# EAGLE design gbit-poe-splitter (EAGLE 9.6.2)
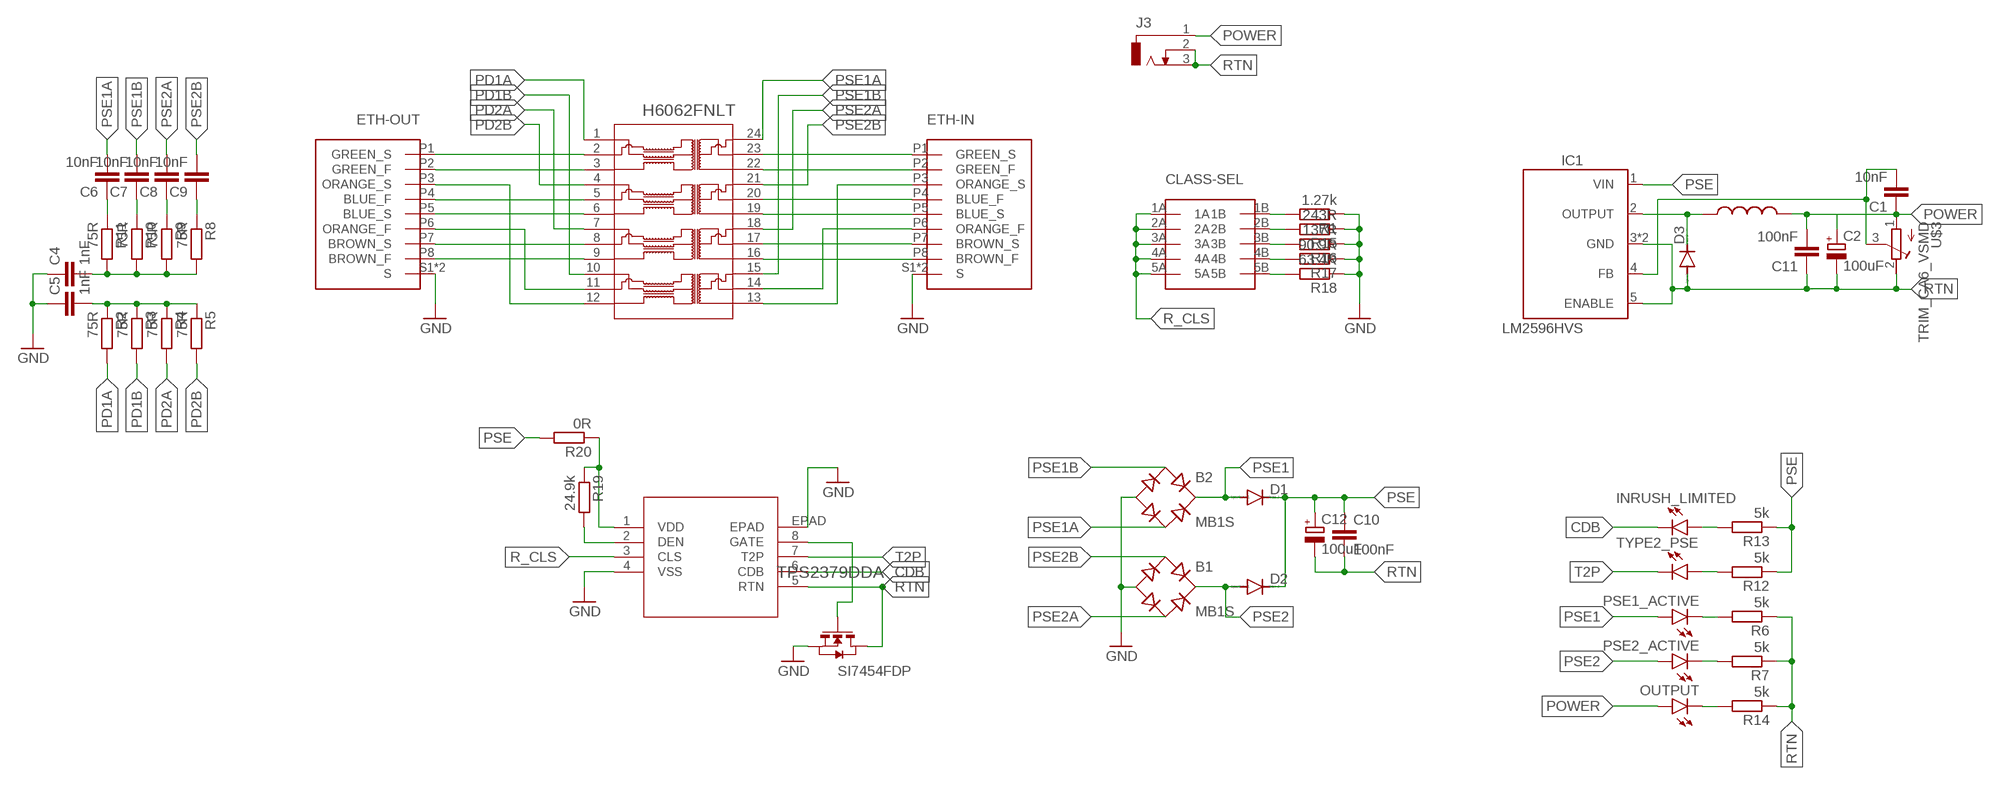
[diagram p0: schematic, sheet 1]

## Parts
B1  MB1S  [SOIC-4]
B2  MB1S  [SOIC-4]
C1  10nF  C-EUC0603K  [C0603K]
C2  100uF  CPOL-EU153CLV-1012  [153CLV-1012]
C4  1nF  C-EUC0603K  [C0603K]
C5  1nF  C-EUC0603K  [C0603K]
C6  10nF  C-EUC0603K  [C0603K]
C7  10nF  C-EUC0603K  [C0603K]
C8  10nF  C-EUC0603K  [C0603K]
C9  10nF  C-EUC0603K  [C0603K]
C10  100nF  C-EUC0805  [C0805]
C11  100nF  C-EUC0805  [C0805]
C12  100uF  CPOL-EU153CLV-1012  [153CLV-1012]
CLASS-SEL  54202-T0803AB01LF  [54202-T0803AB01LF]
D1  DIODE-DO-214AC  [DO-214AC]
D2  DIODE-DO-214AC  [DO-214AC]
D3  DIODE-DO-214AC  [DO-214AC]
ETH-IN  RJLSE-4X1XX-01  [RJLSE-4X1XX-01]
ETH-OUT  RJLSE-4X1XX-01  [RJLSE-4X1XX-01]
IC1  LM2596HVS  [TO263-5]
INRUSH_LIMITED  LEDCHIPLED_0603  [CHIPLED_0603]
J3  DCJ0303  [DCJ0303]
OUTPUT  LEDCHIPLED_0603  [CHIPLED_0603]
PSE1_ACTIVE  LEDCHIPLED_0603  [CHIPLED_0603]
PSE2_ACTIVE  LEDCHIPLED_0603  [CHIPLED_0603]
R1  1.27k  R-EU_R0603  [R0603]
R2  75R  R-EU_R0603  [R0603]
R3  75R  R-EU_R0603  [R0603]
R4  75R  R-EU_R0603  [R0603]
R5  75R  R-EU_R0603  [R0603]
R6  5k  R-EU_R0603  [R0603]
R7  5k  R-EU_R0603  [R0603]
R8  75R  R-EU_R0603  [R0603]
R9  75R  R-EU_R0603  [R0603]
R10  75R  R-EU_R0603  [R0603]
R11  75R  R-EU_R0603  [R0603]
R12  5k  R-EU_R0603  [R0603]
R13  5k  R-EU_R0603  [R0603]
R14  5k  R-EU_R0603  [R0603]
R15  243R  R-EU_R0603  [R0603]
R16  137R  R-EU_R0603  [R0603]
R17  90.9R  R-EU_R0603  [R0603]
R18  63.4R  R-EU_R0603  [R0603]
R19  24.9k  R-EU_R0603  [R0603]
R20  0R  R-EU_R1206  [R1206]
TYPE2_PSE  LEDCHIPLED_0603  [CHIPLED_0603]
U1  TPS2379DDA  [DDA8_3P1X2P4_TEX]
U$1  SI7454FDP  [POWERPAK-SO-8]
U$2  INDUCTOR-SMD7070  [INDUCTOR-SMD]
U$3  TRIM_CA6_VSMD  [TRIM_CA6_VSMD]
XMER1  H6062FNLT  [H6062FNLT_PUL]

## Nets
CDB: INRUSH_LIMITED.C U1.6(CDB)
GND: B1.- B2.- C4.1 C5.1 ETH-IN.S1(S) ETH-IN.S2(S) ETH-OUT.S1(S) ETH-OUT.S2(S) R1.1 R15.1 R16.1 R17.1 R18.1 U1.4(VSS) U1.EPAD U$1.S1(S) U$1.S2(S) U$1.S3(S)
N$1: ETH-OUT.P1(GREEN_S) XMER1.2
N$2: ETH-OUT.P2(GREEN_F) XMER1.3
N$3: ETH-OUT.P3(ORANGE_S) XMER1.12
N$4: ETH-OUT.P4(BLUE_F) XMER1.5
N$5: ETH-OUT.P5(BLUE_S) XMER1.6
N$6: ETH-OUT.P6(ORANGE_F) XMER1.11
N$7: ETH-OUT.P7(BROWN_S) XMER1.8
N$8: ETH-OUT.P8(BROWN_F) XMER1.9
N$9: ETH-IN.P7(BROWN_S) XMER1.17
N$10: ETH-IN.P4(BLUE_F) XMER1.20
N$11: ETH-IN.P8(BROWN_F) XMER1.16
N$12: ETH-IN.P5(BLUE_S) XMER1.19
N$13: ETH-IN.P6(ORANGE_F) XMER1.14
N$14: ETH-IN.P3(ORANGE_S) XMER1.13
N$15: ETH-IN.P2(GREEN_F) XMER1.22
N$16: ETH-IN.P1(GREEN_S) XMER1.23
N$18: C5.2 R2.1 R3.1 R4.1 R5.1
N$19: C4.2 R8.2 R9.2 R10.2 R11.2
N$20: C6.1 R11.1
N$21: C7.1 R10.1
N$22: C8.1 R9.1
N$23: C9.1 R8.1
N$24: PSE1_ACTIVE.C R6.2
N$25: PSE2_ACTIVE.C R7.2
N$26: R12.2 TYPE2_PSE.A
N$27: INRUSH_LIMITED.A R13.2
N$28: OUTPUT.C R14.2
N$29: CLASS-SEL.1B R1.2
N$30: CLASS-SEL.2B R15.2
N$31: CLASS-SEL.3B R16.2
N$32: CLASS-SEL.4B R17.2
N$33: CLASS-SEL.5B R18.2
N$34: D3.C IC1.2(OUTPUT) U$2.1
N$35: U1.8(GATE) U$1.G
N$36: R19.2 U1.2(DEN)
N$37: C1.2 IC1.4(FB) U$3.3(S)
N$38: R19.1 R20.1 U1.1(VDD)
PD1A: R2.2 XMER1.1
PD1B: R3.2 XMER1.10
PD2A: R4.2 XMER1.7
PD2B: R5.2 XMER1.4
POWER: C1.1 C2.+ C11.2 J3.1 OUTPUT.A U$2.2 U$3.1(A)
PSE: C10.1 C12.+ D1.C D2.C IC1.1(VIN) R12.1 R13.1 R20.2
PSE1: B2.+ D1.A PSE1_ACTIVE.A
PSE1A: B2.~2(AC2) C6.2 XMER1.24
PSE1B: B2.~1(AC1) C7.2 XMER1.15
PSE2: B1.+ D2.A PSE2_ACTIVE.A
PSE2A: B1.~2(AC2) C8.2 XMER1.18
PSE2B: B1.~1(AC1) C9.2 XMER1.21
R_CLS: CLASS-SEL.1A CLASS-SEL.2A CLASS-SEL.3A CLASS-SEL.4A CLASS-SEL.5A U1.3(CLS)
RTN: C2.- C10.2 C11.1 C12.- D3.A IC1.3(GND) IC1.5(ENABLE) IC1.6(GND) J3.2 J3.3 R6.1 R7.1 R14.1 U1.5(RTN) U$1.D1(D) U$1.D2(D) U$1.D3(D) U$1.D4(D) U$1.DPAD(D) U$3.2(E)
T2P: TYPE2_PSE.C U1.7(T2P)

## Library data of the parts
B1 B2 = rectifier:MB*S: Bridge Rectifier Source: http://www.fairchildsemi.com/ds/MB/MB6S.pdf
C1 C4-C11 = rcl:C-EU: CAPACITOR, European symbol; SPICEPREFIX: C
C2 C12 = rcl:CPOL-EU: POLARIZED CAPACITOR, European symbol; SPICEPREFIX: C
CLASS-SEL = 54202-T0803AB01LF:54202-T0803AB01LF
D1-D3 = diode:DIODE-: DIODE
ETH-IN ETH-OUT = RJLSE-4X1XX-01:RJLSE-4X1XX-01
IC1 = LM2596HV:LM2596HV
INRUSH_LIMITED OUTPUT PSE1_ACTIVE PSE2_ACTIVE TYPE2_PSE = led:LED: LED OSRAM: - CHIPLED LG R971, LG N971, LY N971, LG Q971, LY Q971, LO R971, LY R971 LH N974, LH R974 LS Q976, LO Q976, LY Q976 LO Q996 - Hyper CHIPLED LW Q18S LB Q993, LB Q99A, LB R99A - SideLED LS A670, LO A670, LY A670, LG A670, LP A670 LB A673, LV A673, LT A673, LW A673 LH A674 LY A675 LS A676, LA A676, LO A676, LY A676, LW A676 LS A679, LY A679, LG A679 - Hyper Micro SIDELED® LS Y876, LA Y876, LO Y876, LY Y876 LT Y87S - SmartLED LW L88C, LW L88S LB L89C, LB L89S, LG L890 LS L89K, LO L89K, LY L89K LS L896, LA L896, LO L896, LY L896 - TOPLED LS T670, LO T670, LY T670, LG T670, LP T670 LSG T670, LSP T670, LSY T670, LOP T670, LYG T670 LG T671, LOG T671, LSG T671 LB T673, LV T673, LT T673, LW T673 LH T674 LS T676, LA T676, LO T676, LY T676, LB T676, LH T676, LSB T676, LW T676 LB T67C, LV T67C, LT T67C, LS T67K, LO T67K, LY T67K, LW E67C LS E67B, LA E67B, LO E67B, LY E67B, LB E67C, LV E67C, LT E67C LW T67C LS T679, LY T679, LG T679 LS T770, LO T770, LY T770, LG T770, LP T770 LB T773, LV T773, LT T773, LW T773 LH T774 LS E675, LA E675, LY E675, LS T675 LS T776, LA T776, LO T776, LY T776, LB T776 LHGB T686 LT T68C, LB T68C - Hyper Mini TOPLED® LB M676 - Mini TOPLED Santana® LG M470 LS M47K, LO M47K, LY M47K Source: http://www.osram.convergy.de LUXEON: - LUMILED® LXK2-PW12-R00, LXK2-PW12-S00, LXK2-PW14-U00, LXK2-PW14-V00 LXK2-PM12-R00, LXK2-PM12-S00, LXK2-PM14-U00 LXK2-PE12-Q00, LXK2-PE12-R00, LXK2-PE12-S00, LXK2-PE14-T00, LXK2-PE14-U00 LXK2-PB12-K00, LXK2-PB12-L00, LXK2-PB12-M00, LXK2-PB14-N00, LXK2-PB14-P00, LXK2-PB14-Q00 LXK2-PR12-L00, LXK2-PR12-M00, LXK2-PR14-Q00, LXK2-PR14-R00 LXK2-PD12-Q00, LXK2-PD12-R00, LXK2-PD12-S00 LXK2-PH12-R00, LXK2-PH12-S00 LXK2-PL12-P00, LXK2-PL12-Q00, LXK2-PL12-R00 Source: www.luxeon.com KINGBRIGHT: KA-3528ASYC Source: www.kingbright.com
J3 = con-jack:DCJ0303: DC POWER JACK Source: DCJ0303.pdf; OC_FARNELL: unknown; OC_NEWARK: unknown
R1-R20 = rcl:R-EU_: RESISTOR, European symbol; SPICEPREFIX: R
U1 = TPS2379:TPS2379DDA; COPYRIGHT: Copyright (C) 2021 Ultra Librarian. All rights reserved.; MANUFACTURER_PART_NUMBER: TPS2379DDA; MFR_NAME: Texas Instruments
U$1 = SI7454FDP:SI7454FDP
U$2 = smd-inductors:INDUCTOR-SMD
U$3 = TRIM_CA6_VSMD:TRIM_CA6_VSMD
XMER1 = H6062FNLT:H6062FNLT; COPYRIGHT: Copyright (C) 2021 Ultra Librarian. All rights reserved.; MANUFACTURER_PART_NUMBER: H6062FNLT; MFR_NAME: Pulse Electronics Corporation

## Board
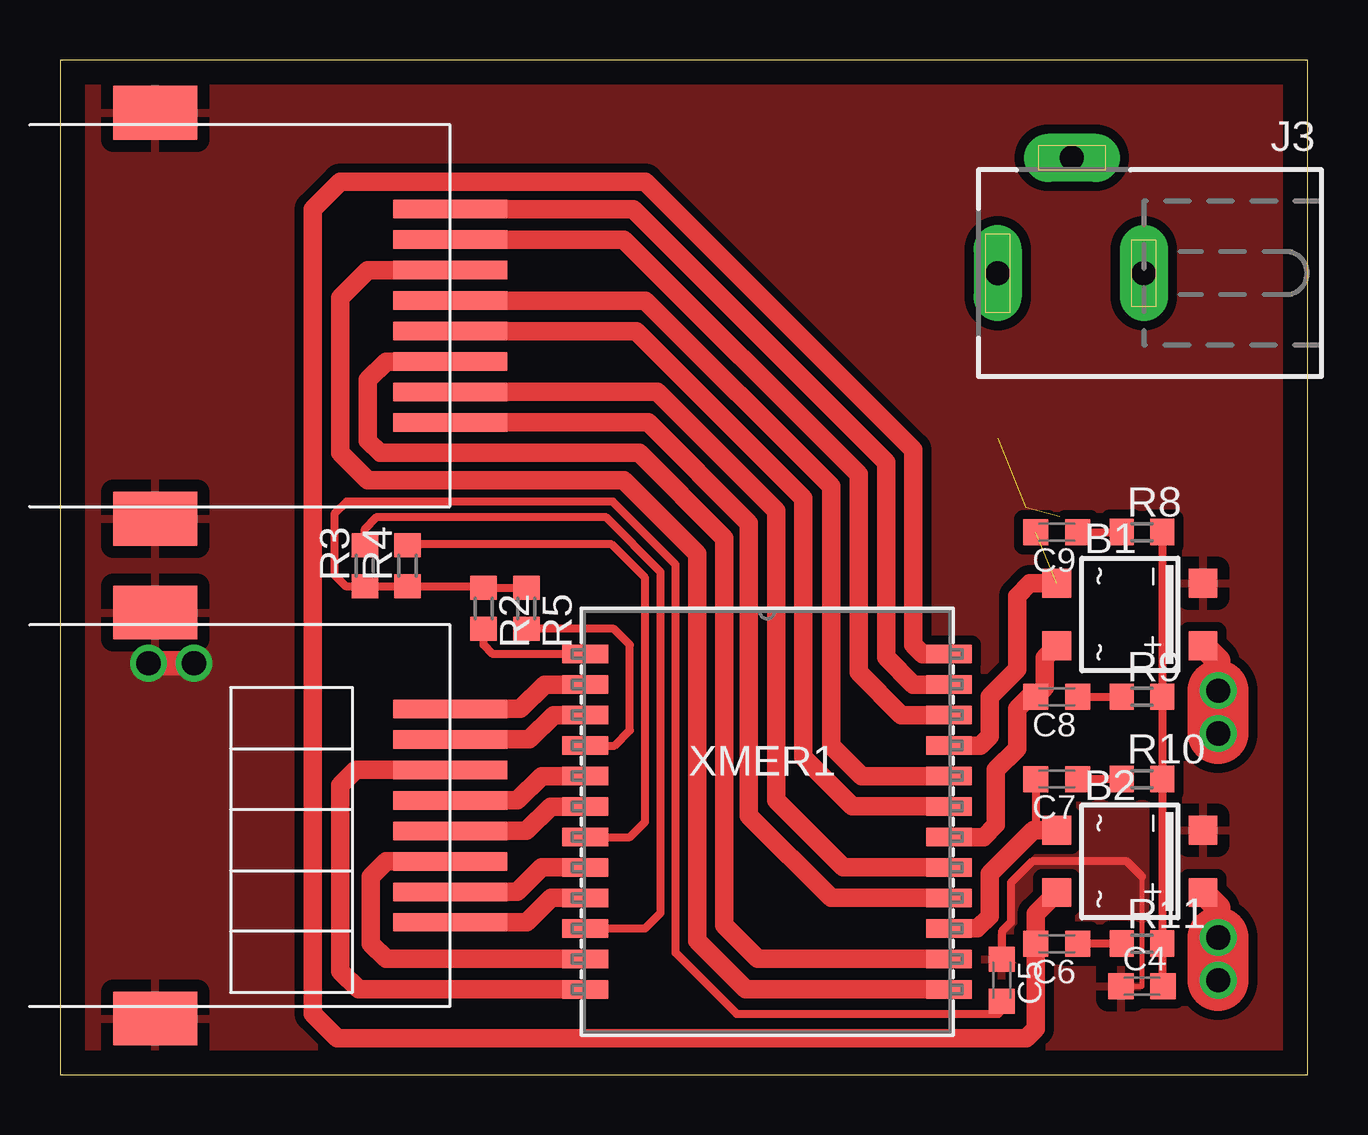
[diagram p1: board, top side]
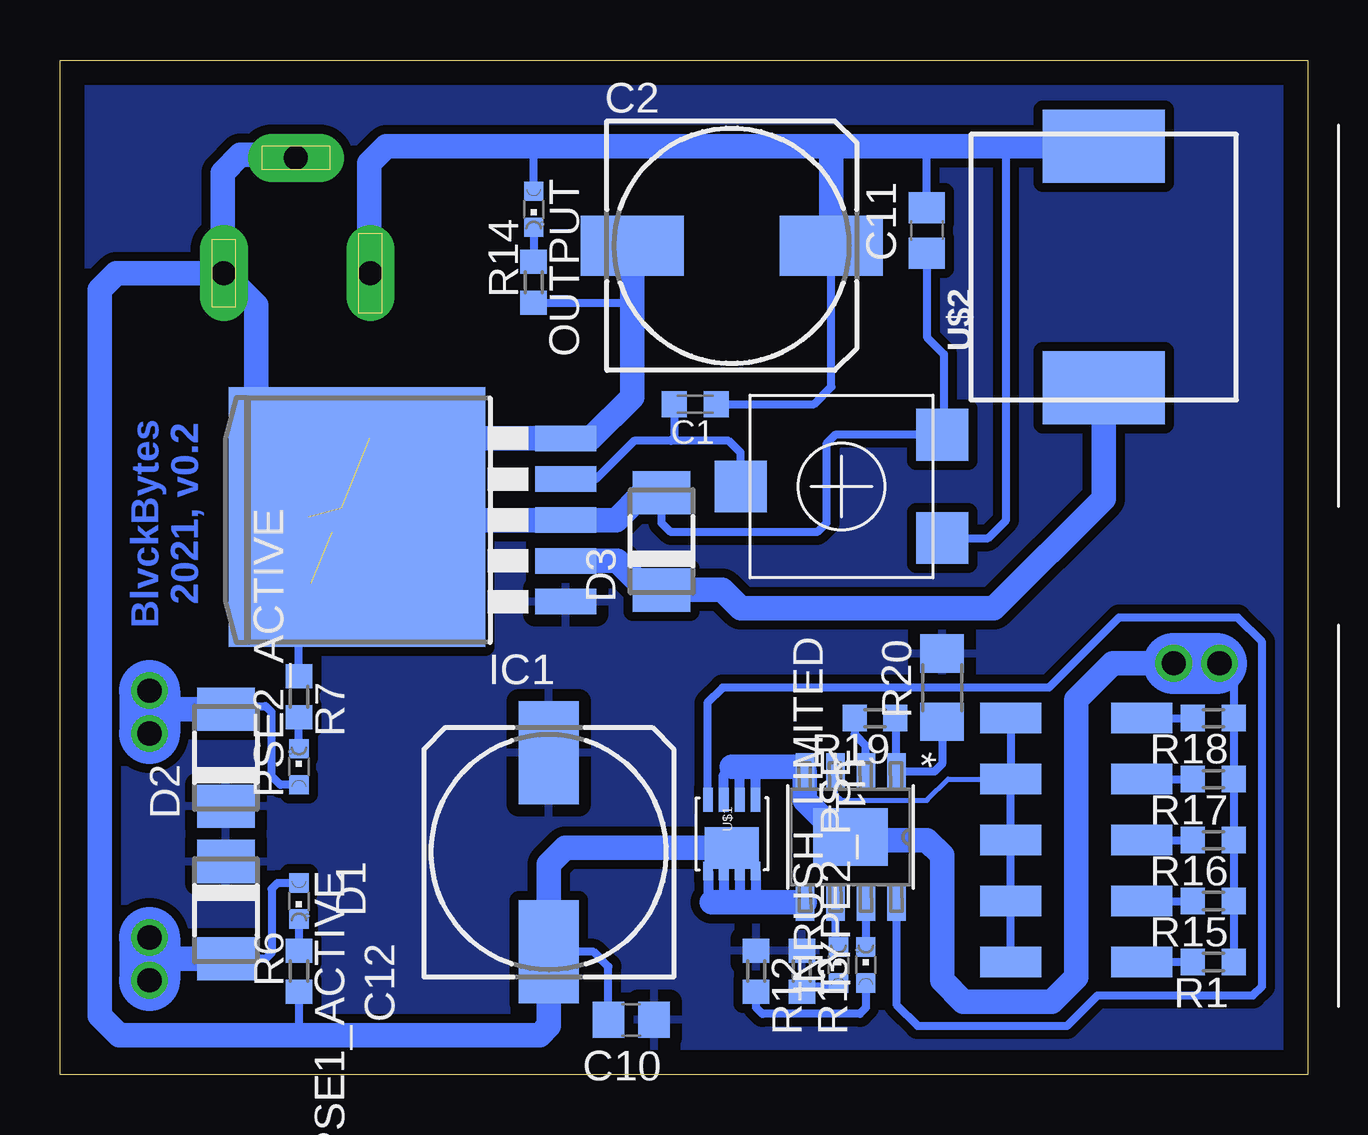
[diagram p2: board, bottom side, seen from below]

Size 51.99 x 42.28 mm. Coordinates in mm from the lower left corner, seen from the top.
Outline: 0,0 51.99,0 51.99,42.28 0,42.28 0,0
Copper layers (1*16): Top 0.035mm / dielectric 1.5mm / Bottom 0.035mm
Design rules "default *": minimum track width 6mil, minimum drill 0.35mm, track to track 6mil, track to pad 6mil, pad to pad 6mil, via to via 6mil, smd to smd 6mil, copper to edge 40mil, drill to drill 6mil, minimum pad ring 10mil, minimum via ring 8mil, stop-mask expansion 4mil, vias tented up to drill 0mil, thermal gap 20mil

### Footprints (pad centres in the part's own frame; a part is rotated, then mirrored left to right if it is on the bottom)
SOIC-4 = smd 1.2 x 1.2: + 1.3,3.05; - -1.3,3.05; ~1 -1.3,-3.05; ~2 1.3,-3.05
C0603K = smd 1.05 x 1.08: 1 -0.875,0; 2 0.875,0
153CLV-1012 = smd 4.3 x 2.5: + 4.15,0; - -4.15,0
C0805 = smd 1.3 x 1.5: 1 -0.95,0; 2 0.95,0
54202-T0803AB01LF = smd 1.27 x 2.54: 1A -5.08,2.731; 1B -5.08,-2.731; 2A -2.54,2.731; 2B -2.54,-2.731; 3A 0,2.731; 3B 0,-2.731; 4A 2.54,2.731; 4B 2.54,-2.731; 5A 5.08,2.731; 5B 5.08,-2.731
DO-214AC = smd 1.8 x 2.4: A 2.025,0; C -2.025,0
RJLSE-4X1XX-01 = smd 0.762 x 4.75: P1 -4.445,8.763; P2 -3.175,8.763; P3 -1.905,8.763; P4 -0.635,8.763; P5 0.635,8.763; P6 1.905,8.763; P7 3.175,8.763; P8 4.445,8.763 | smd 2.235 x 3.505: S1 -8.458,-3.531; S2 8.458,-3.531
TO263-5 = smd 1.067 x 2.54: 1 -3.404,-6.045; 2 -1.702,-6.045; 3 0,-6.045; 4 1.702,-6.045; 5 3.404,-6.045 | smd 10.8 x 10.689: 6 0.127,2.667
CHIPLED_0603 = smd 0.8 x 0.8: A 0,-0.75; C 0,0.75
DCJ0303 = drill 1 pad 2 long: 1 0,3.1; 2 4.8,0; 3 0,-3
R0603 = smd 1 x 1.1: 1 -0.85,0; 2 0.85,0
R1206 = smd 1.6 x 1.803: 1 -1.422,0; 2 1.422,0
DDA8_3P1X2P4_TEX = smd 1.524 x 0.762: 1 -2.724,1.905; 2 -2.724,0.635; 3 -2.724,-0.635; 4 -2.724,-1.905; 5 2.724,-1.905; 6 2.724,-0.635; 7 2.724,0.635; 8 2.724,1.905 | smd 2.4 x 3.1: EPAD 0,0
POWERPAK-SO-8 = smd 0.762 x 0.406: D1 1.549,0.991; D2 1.549,0.33; D3 1.549,-0.33; D4 1.549,-0.991 | smd 1.727 x 2.235: DPAD 0.584,0 | smd 0.991 x 0.406: G -1.422,-0.991; S1 -1.422,0.991; S2 -1.422,0.33; S3 -1.422,-0.33
INDUCTOR-SMD = smd 3.048 x 5.08: 1 -5.032,0; 2 5.032,0
TRIM_CA6_VSMD = smd 2.159 x 2.159: 1 -2.15,-4.2; 2 2.15,-4.2; 3 0,4.2
H6062FNLT_PUL = smd 1.905 x 0.762: 1 -7.582,6.985; 2 -7.582,5.715; 3 -7.582,4.445; 4 -7.582,3.175; 5 -7.582,1.905; 6 -7.582,0.635; 7 -7.582,-0.635; 8 -7.582,-1.905; 9 -7.582,-3.175; 10 -7.582,-4.445; 11 -7.582,-5.715; 12 -7.582,-6.985; 13 7.582,-6.985; 14 7.582,-5.715; 15 7.582,-4.445; 16 7.582,-3.175; 17 7.582,-1.905; 18 7.582,-0.635; 19 7.582,0.635; 20 7.582,1.905; 21 7.582,3.175; 22 7.582,4.445; 23 7.582,5.715; 24 7.582,6.985

### Placement (x,y rotation side)
B1  44.58,19.18 270 top
B2  44.58,8.89 270 top
C1  25.53,27.94 180 bottom
C2  24,34.54 0 bottom
C4  45.09,3.68 0 top
C5  39.24,3.94 270 top
C6  41.53,5.46 180 top
C7  41.53,12.32 180 top
C8  41.53,15.75 180 top
C9  41.53,22.61 180 top
C10  28.19,2.29 180 bottom
C11  15.88,35.18 90 bottom
C12  31.62,9.27 90 bottom
CLASS-SEL  9.65,9.78 90 bottom
D1  45.09,6.86 270 bottom
D2  45.09,13.21 90 bottom
D3  26.92,22.23 90 bottom
ETH-IN  7.49,31.62 270 top
ETH-OUT  7.49,10.8 270 top
IC1  36.96,23.11 90 bottom
INRUSH_LIMITED  19.56,4.57 0 bottom
J3  42.16,33.4 90 top
OUTPUT  32.26,36.07 180 bottom
PSE1_ACTIVE  42.04,7.24 180 bottom
PSE2_ACTIVE  42.04,12.83 0 bottom
R1  3.94,4.7 180 bottom
R2  17.65,19.43 270 top
R3  12.7,21.21 90 top
R4  14.48,21.21 90 top
R5  19.43,19.43 270 top
R6  42.04,4.32 90 bottom
R7  42.04,15.75 270 bottom
R8  45.09,22.61 0 top
R9  45.09,15.75 0 top
R10  45.09,12.32 0 top
R11  45.09,5.46 0 top
R12  22.99,4.32 270 bottom
R13  21.08,4.32 270 bottom
R14  32.26,33.02 90 bottom
R15  3.94,7.24 180 bottom
R16  3.94,9.78 180 bottom
R17  3.94,12.32 180 bottom
R18  3.94,14.86 180 bottom
R19  18.03,14.86 180 bottom
R20  15.24,16.13 90 bottom
TYPE2_PSE  18.41,4.57 0 bottom
U1  19.05,9.91 270 bottom
U$1  24,10.03 270 bottom
U$2  8.51,33.66 90 bottom
U$3  19.43,24.51 90 bottom
XMER1  29.46,10.54 0 top

### Tracks (layer width: path | path; a pad name or v marks a point on that pad's centre or on a via)
CDB
  Bottom 0.33: U1.6 19.68,5.45 INRUSH_LIMITED.C
GND  (via drill 1.02)
  Top 0.203: C4.1 45.09,3.68 45.09,8.25
  Top 0.33: 45.09,8.25 44.45,8.89 40.51,8.89 39.62,8 39.62,6.35 39.24,5.97 C5.1
  Top 1.016: v3.68,17.14 v5.59,17.14
  Bottom 0.33: v3.68,17.14 3.09,16.55 R18.1 R17.1 R16.1 R15.1 R1.1
  Bottom 0.406: U$1.S1 23.01,12.8 22.99,12.83 | U$1.S2 23.67,12.5 24,12.83 24.33,12.5 U$1.S3
  Bottom 0.762: U1.EPAD 19.43,9.91
  Bottom 1.016: 19.43,9.91 20.95,11.43 U1.4 21.15,12.83 22.99,12.83 24,12.83 | U1.EPAD 18.92,9.78 15.88,9.78 15.24,9.14 15.24,3.94 14.35,3.05 10.67,3.05 9.65,4.06 9.65,15.62 8.13,17.14 v5.59,17.14
  Bottom 2.54: v5.59,17.14 3.81,17.14
  pour Top (isolate 0.381): 0,0.13 50.8,0.13 50.8,42.04 0,42.04
N$1
  Top 0.762: XMER1.2 20.19,16.26 19.18,15.24 ETH-OUT.P1
N$2
  Top 0.762: XMER1.3 20.57,14.99 19.56,13.97 ETH-OUT.P2
N$3
  Top 0.762: XMER1.12 12.45,3.56 11.68,4.32 11.68,12.07 12.32,12.7 ETH-OUT.P3
N$4
  Top 0.762: ETH-OUT.P4 19.05,11.43 20.07,12.45 XMER1.5
N$5
  Top 0.762: ETH-OUT.P5 19.43,10.16 20.45,11.18 XMER1.6
N$6
  Top 0.762: ETH-OUT.P6 13.59,8.89 12.95,8.25 12.95,5.46 13.59,4.83 XMER1.11
N$7
  Top 0.762: ETH-OUT.P7 19.05,7.62 20.07,8.64 XMER1.8
N$8
  Top 0.762: ETH-OUT.P8 19.45,6.35 20.47,7.37 XMER1.9
N$9
  Top 0.762: ETH-IN.P7 24.89,28.45 29.84,23.5 29.84,11.43 32.64,8.64 XMER1.17
N$10
  Top 0.762: ETH-IN.P4 24.38,32.26 32.13,24.51 32.13,13.72 33.4,12.45 XMER1.20
N$11
  Top 0.762: ETH-IN.P8 24.51,27.18 28.7,22.99 28.7,10.8 32.13,7.37 XMER1.16
N$12
  Top 0.762: XMER1.19 37.03,11.19 33,11.19 30.97,13.23 30.97,24.02 24,30.99 ETH-IN.P5
N$13
  Top 0.762: ETH-IN.P6 13.59,29.72 12.83,28.96 12.83,26.42 13.34,25.91 24.13,25.91 27.69,22.35 27.69,6.22 29.08,4.83 XMER1.14
N$14
  Top 0.762: ETH-IN.P3 12.83,33.53 11.68,32.38 11.68,25.91 12.83,24.77 23.5,24.77 26.54,21.72 26.54,5.59 28.57,3.56 XMER1.13
N$15
  Top 0.762: XMER1.22 35.05,14.99 33.27,16.76 33.27,25.02 23.5,34.8 ETH-IN.P2
N$16
  Top 0.762: XMER1.23 35.56,16.26 34.42,17.4 34.42,25.53 23.88,36.07 ETH-IN.P1
N$18
  Top 0.33: C5.2 39.24,2.68 39.1,2.54 28.19,2.54 25.65,5.08 25.65,21.26 23.04,23.88 11.94,23.88 11.43,23.37 11.43,20.83 11.9,20.36 R3.1 R4.1 17.57,20.36 R2.1 R5.1
N$19
  Top 0.33: R8.2 R9.2 R10.2 R11.2 45.94,3.71 C4.2
N$20
  Top 0.33: R11.1 C6.1
N$21
  Top 0.33: R10.1 C7.1
N$22
  Top 0.33: C8.1 R9.1
N$23
  Top 0.33: C9.1 R8.1
N$24
  Bottom 0.33: PSE1_ACTIVE.C R6.2
N$25
  Bottom 0.33: PSE2_ACTIVE.C R7.2
N$26
  Bottom 0.33: TYPE2_PSE.A 18.41,2.79 18.67,2.54 22.73,2.54 22.99,2.79 R12.2
N$27
  Bottom 0.33: INRUSH_LIMITED.A 19.68,3.69 20.86,3.69 R13.2
N$28
  Bottom 0.33: OUTPUT.C R14.2
N$29
  Bottom 0.33: CLASS-SEL.1B R1.2
N$30
  Bottom 0.33: CLASS-SEL.2B R15.2
N$31
  Bottom 0.33: CLASS-SEL.3B R16.2
N$32
  Bottom 0.33: CLASS-SEL.4B R17.2
N$33
  Bottom 0.33: CLASS-SEL.5B R18.2
N$34
  Bottom 1.016: U$2.1 8.51,24 13.08,19.43 23.62,19.43 24.39,20.2 D3.C 27.57,20.2 28.78,21.41 IC1.2
N$35
  Bottom 0.33: U1.8 17.14,2.92 16.26,2.03 10.03,2.03 8.76,3.3 2.29,3.3 1.91,3.68 1.91,18.03 2.92,19.05 7.87,19.05 10.79,16.13 24.38,16.13 25.02,15.49 25.02,11.48 U$1.G
N$36
  Bottom 0.33: U1.2 18.41,13.72 18.88,14.19 R19.2
N$37
  Bottom 0.33: U$3.3 23.63,25.92 24.13,26.42 26.54,26.42 | IC1.4 29.67,24.82 28.07,26.42 26.54,26.42 | C1.2 26.4,26.56 26.54,26.42
N$38
  Bottom 0.33: R19.1 17.14,14.82 U1.1 15.56,12.63 15.24,12.95 R20.1
PD1A
  Top 0.33: XMER1.1 18.03,17.53 17.65,17.91 R2.2
PD1B
  Top 0.33: XMER1.10 24.38,6.1 25.02,6.73 25.02,20.96 22.73,23.24 13.21,23.24 12.7,22.73 R3.2
PD2A
  Top 0.33: XMER1.7 23.75,9.91 24.38,10.54 24.38,20.7 22.99,22.1 14.99,22.1 14.95,22.06 R4.2
PD2B
  Top 0.33: XMER1.4 23.11,13.72 23.75,14.35 23.75,17.91 23.07,18.58 R5.2
POWER
  Bottom 0.33: C11.2 15.88,38.69 | C1.1 20.57,27.94 19.85,28.66 C2.+ | U$3.1 13.33,22.36 12.57,23.11 12.57,38.69 | OUTPUT.A 32.26,38.69
  Bottom 1.016: J3.1 39.12,33.45 39.12,37.97 38.4,38.69 32.26,38.69 19.81,38.69 | U$2.2 12.57,38.69 15.88,38.69 19.81,38.69 | C2.+ 19.85,38.65 19.81,38.69
PSE
  pour Bottom (isolate 0.381): 0,42.04 0,0.13 51.82,0.13 51.82,42.04
PSE1  (via drill 1.02)
  Top 1.016: B2.+ 48.26,6.96 v48.26,5.72
  Top 2.54: v48.26,3.94 v48.26,5.72
  Bottom 0.33: PSE1_ACTIVE.A 42.94,7.99 43.18,7.75 43.18,5.08 43.43,4.83 D1.A
  Bottom 1.016: D1.A 47.38,4.83 v48.26,5.72
  Bottom 2.54: v48.26,5.72 v48.26,3.94
PSE1A
  Top 0.762: XMER1.24 35.94,17.53 35.56,17.91 35.56,26.04 24.38,37.21 11.68,37.21 10.54,36.07 10.54,2.54 11.56,1.52 40.26,1.52 40.65,1.92 C6.2 40.65,6.72 B2.~2
PSE1B
  Top 0.33: C7.2 40.65,10.3 40.54,10.19
  Top 0.762: XMER1.15 38.23,6.1 38.73,6.6 38.73,8.38 40.54,10.19 B2.~1
PSE2  (via drill 1.02)
  Top 1.016: B1.+ 48.26,17.24 v48.26,16
  Top 2.54: v48.26,14.22 v48.26,16
  Bottom 0.33: PSE2_ACTIVE.A 42.81,12.08 43.18,12.45 43.18,15.11 43.43,15.36 44.96,15.36 D2.A
  Bottom 1.016: v48.26,16 47.49,15.23 D2.A
  Bottom 2.54: v48.26,16 v48.26,14.22
PSE2A
  Top 0.762: B1.~2 41.03,17.39 41.03,16.13 C8.2 40.39,15.75 39.88,15.24 39.88,13.59 38.99,12.7 38.99,10.41 38.48,9.91 XMER1.18
PSE2B  (1 unrouted)
  Top 0.762: B1.~1 40.42,20.48 39.88,19.94 39.88,16.89 38.73,15.75 38.73,14.1 38.35,13.72 XMER1.21
R_CLS
  Bottom 0.203: U1.3 19.68,11.68 19.43,11.43 15.88,11.43 14.99,12.32 CLASS-SEL.4A
  Bottom 0.33: CLASS-SEL.5A CLASS-SEL.4A CLASS-SEL.3A CLASS-SEL.2A CLASS-SEL.1A
RTN  (2 unrouted)
  Bottom 0.33: 15.05,26.84 15.17,26.73 | 15.17,26.73 U$3.2 19.69,26.66 20.07,26.29 20.07,22.99 20.45,22.61 26.54,22.61 26.92,22.99 D3.A | R6.1 42.04,1.65 | 40.26,23.62 40.01,23.62 | C10.2 29.14,4.51 29.76,5.12 C12.- | C11.1 15.88,30.73 15.17,30.03 15.17,26.73 | R14.1 28.24,32.17 28.15,32.26 | 42.04,22.86 41.91,22.99 | R7.1 42.04,23.11 | 42.16,23.11 42.29,23.24
  Bottom 0.406: U$1.D1 23.01,7.21 22.99,7.18 | U$1.D2 23.67,7.36 23.5,7.18 | 24.26,7.18 24.33,7.26 U$1.D3 24.33,9.12 U$1.DPAD | U$1.D4 24.99,7.33 24.84,7.18
  Bottom 1.016: D3.A 27.69,24.25 28.82,23.11 IC1.3 36.83,23.11 36.96,23.24 39.12,23.24 | J3.2 42.29,38.33 44.48,38.33 45.21,37.59 45.21,33.45 J3.3 | 39.37,26.8 39.09,26.52 | 41.91,22.99 41.66,23.24 | IC1.6 40.01,23.62 | U$1.DPAD 30.94,9.45 31.62,8.76 C12.- 31.62,2.03 32,1.65 42.04,1.65 49.53,1.65 50.34,2.46 50.34,32.72 49.66,33.4 J3.3 | C2.- 28.15,32.26 28.15,28.23 29.87,26.52 IC1.5 39.59,26.52 | J3.3 44.32,32.56 | 44.45,22.99 43.18,22.99 43.05,23.11 42.16,23.11 42.04,23.11 | 44.17,26.52 44.45,26.8 43.81,27.43 | U1.5 22.99,7.18 23.5,7.18 24.26,7.18 24.84,7.18 | J3.3 43.81,32.05 43.81,27.43 | 43.81,27.3 43.81,27.43 | IC1.6 42.29,23.24 | 43.81,27.43 42.9,26.52 39.59,26.52 | 39.12,23.24 38.1,24.26 38.61,24.26 IC1.6 | IC1.6 39.59,23.28 39.59,26.52 | IC1.6 39.12,23.24
T2P
  Bottom 0.33: U1.7 TYPE2_PSE.C

### Text on the board
Bottom: BlvckBytes | 2021, v0.2